# Altium schematic sheet PWM.SchDoc: Inverter
size A3; ApprovedBy: Yves Chevallier; CheckedBy: Yves Chevallier; Author: Yves Chevallier; CompanyName: EPFL; DrawnBy: Yves Chevallier; Engineer: Yves Chevallier; Organization: EPFL; Address1: EPFL; Address2: CH1015 Lausanne; Address3: +41(0)21 693 36 98; Address4: +41(0)21 693 26 00; DocumentNumber: ABC.00.0000.000.0; Revision: v1.0; SheetNumber: 0; SheetTotal: 0; DrawnByDate: 2000-01-01; ExecutionWarrantDate: 2000-01-01; ExecutionWarrant: Yves Chevallier; Context: Confidential; PageSetup: Record=PageOptions|CenterHorizontal=True|CenterVertical=False|PrintScale=0.97|XCorrection=1.00|YCorrection=1.00|PrintKind=0|BorderSize=5000000|LeftOffset=0|BottomOffset=0|Orientation=2|PaperLength=1000|PaperWidth=1000|Scale=100|PaperSource=262|PrintQuality=600|MediaType=1|DitherType=10|PaperKind=A4|PrintScaleMode=1; EngineerDate: 2000-01-01; CheckedByDate: 2000-01-01; ProjectName: PRJ
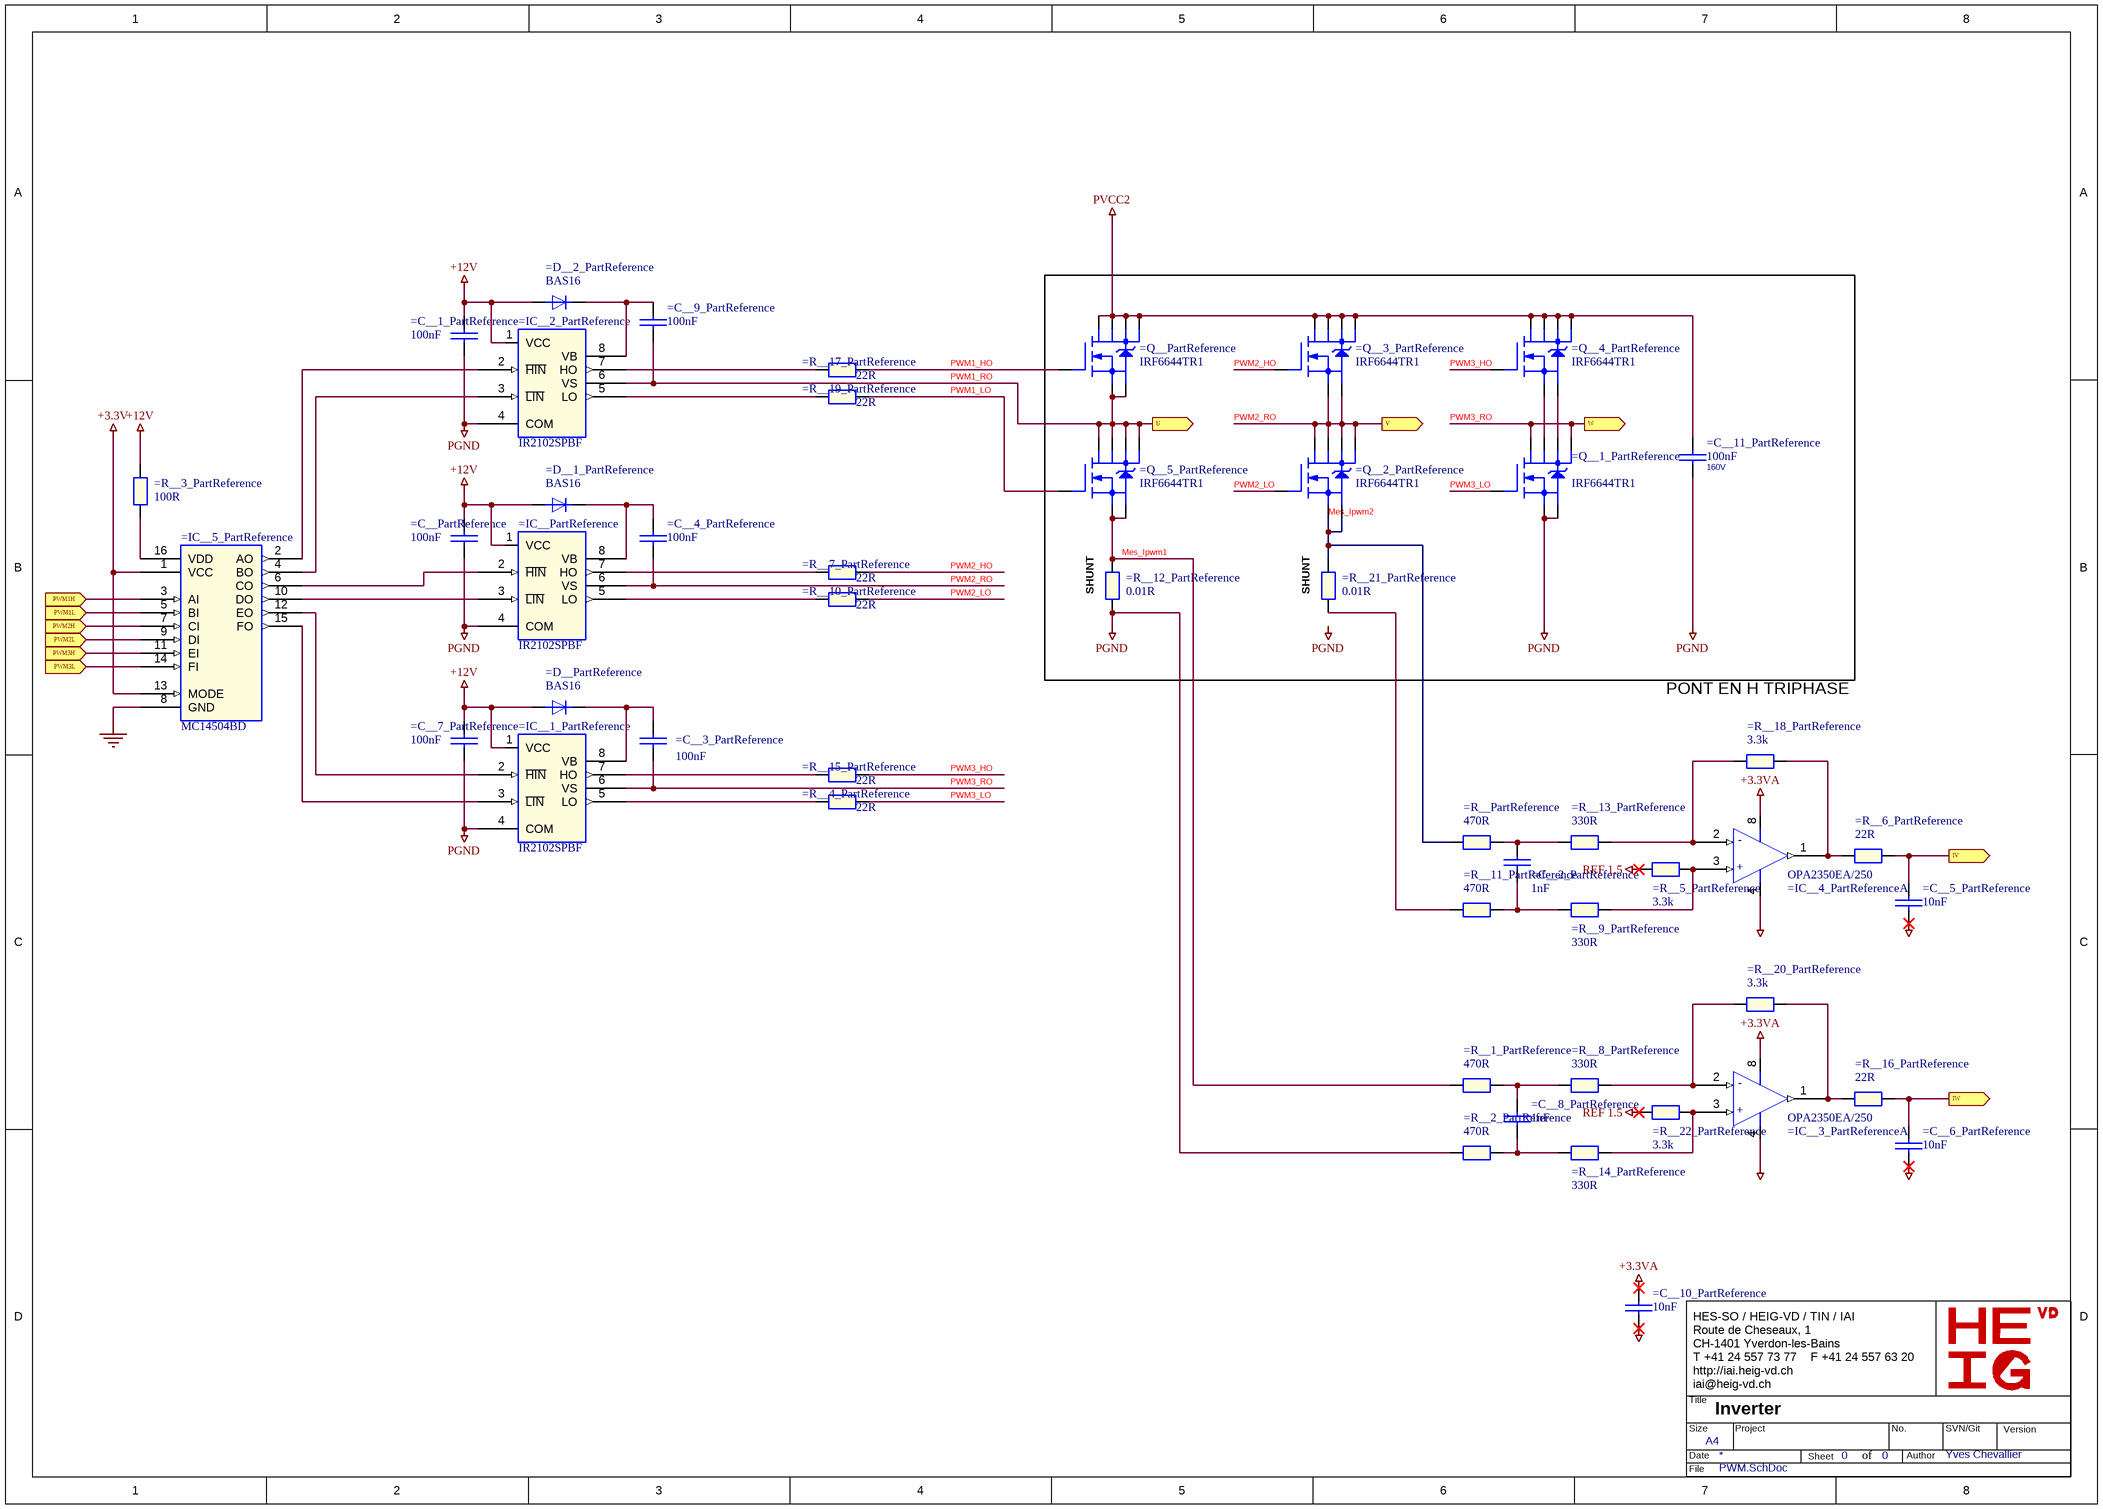
[diagram p0: PWM.SchDoc]

## Parts
=C__1_PartReference  100nF  [SM/C_0805]
=C__2_PartReference  1nF  [SM/C_0805]
=C__3_PartReference  100nF  [SM/C_0805]
=C__4_PartReference  100nF  [SM/C_0805]
=C__5_PartReference  10nF  [SM/C_0805]
=C__6_PartReference  10nF  [SM/C_0805]
=C__7_PartReference  100nF  [SM/C_0805]
=C__8_PartReference  1nF  [SM/C_0805]
=C__9_PartReference  100nF  [SM/C_0805]
=C__10_PartReference  10nF  [SM/C_0805]
=C__11_PartReference  100nF  VOLTAGE: 160V  [SM/C_0805]
=C__PartReference  100nF  [SM/C_0805]
=D__1_PartReference  BAS16  [HEIG/SM/SOT23]
=D__2_PartReference  BAS16  [HEIG/SM/SOT23]
=D__PartReference  BAS16  [HEIG/SM/SOT23]
=IC__1_PartReference  IR2102SPBF  [SOG.050/8/WG.244/L.200]
=IC__2_PartReference  IR2102SPBF  [SOG.050/8/WG.244/L.200]
=IC__3_PartReference  OPA2350EA/250  [HEIG/SM/MSOP8]  (part A of 2)
=IC__4_PartReference  OPA2350EA/250  [HEIG/SM/MSOP8]  (part A of 2)
=IC__5_PartReference  MC14504BD  [SOG.050/16/WG.244/L.400]
=IC__PartReference  IR2102SPBF  [SOG.050/8/WG.244/L.200]
=Q__1_PartReference  IRF6644TR1  [HEIG/DIRECTFET/MN]
=Q__2_PartReference  IRF6644TR1  [HEIG/DIRECTFET/MN]
=Q__3_PartReference  IRF6644TR1  [HEIG/DIRECTFET/MN]
=Q__4_PartReference  IRF6644TR1  [HEIG/DIRECTFET/MN]
=Q__5_PartReference  IRF6644TR1  [HEIG/DIRECTFET/MN]
=Q__PartReference  IRF6644TR1  [HEIG/DIRECTFET/MN]
=R__1_PartReference  470R  [R400]
=R__2_PartReference  470R  [R400]
=R__3_PartReference  100R  [R400]
=R__4_PartReference  22R  [R400]
=R__5_PartReference  3.3k  [R400]
=R__6_PartReference  22R  [R400]
=R__7_PartReference  22R  [R400]
=R__8_PartReference  330R  [R400]
=R__9_PartReference  330R  [R400]
=R__10_PartReference  22R  [R400]
=R__11_PartReference  470R  [R400]
=R__12_PartReference  0.01R  [R400]
=R__13_PartReference  330R  [R400]
=R__14_PartReference  330R  [R400]
=R__15_PartReference  22R  [R400]
=R__16_PartReference  22R  [R400]
=R__17_PartReference  22R  [R400]
=R__18_PartReference  3.3k  [R400]
=R__19_PartReference  22R  [R400]
=R__20_PartReference  3.3k  [R400]
=R__21_PartReference  0.01R  [R400]
=R__22_PartReference  3.3k  [R400]
=R__PartReference  470R  [R400]

## Ports
IV (out), IW (out), PWM1H (in), PWM1L (in), PWM2H (in), PWM2L (in), PWM3H (in), PWM3L (in), U (out), V (out), W (out)

## Nets
+3.3V: =IC__5_PartReference.1(VCC) =IC__5_PartReference.13(MODE)
+3.3VA: =C__10_PartReference.1 =IC__3_PartReference.8(+VCC) =IC__4_PartReference.8(+VCC)
+12V: =C__1_PartReference.1 =C__7_PartReference.1 =C__PartReference.1 =D__1_PartReference.1(a) =D__2_PartReference.1(a) =D__PartReference.1(a) =IC__1_PartReference.1(VCC) =IC__2_PartReference.1(VCC) =IC__PartReference.1(VCC) =R__3_PartReference.2
AGND: =C__5_PartReference.2 =C__6_PartReference.2 =C__10_PartReference.2 =IC__3_PartReference.4(-VCC) =IC__4_PartReference.4(-VCC)
GND: =IC__5_PartReference.8(GND)
PGND: =C__1_PartReference.2 =C__7_PartReference.2 =C__11_PartReference.2 =C__PartReference.2 =IC__1_PartReference.4(COM) =IC__2_PartReference.4(COM) =IC__PartReference.4(COM) =Q__1_PartReference.S1(S) =Q__1_PartReference.S2(S) =R__2_PartReference.1 =R__12_PartReference.2
PVCC2: =C__11_PartReference.1 =Q__3_PartReference.D1(D) =Q__3_PartReference.D2(D) =Q__3_PartReference.D3(D) =Q__3_PartReference.D4(D) =Q__4_PartReference.D1(D) =Q__4_PartReference.D2(D) =Q__4_PartReference.D3(D) =Q__4_PartReference.D4(D) =Q__PartReference.D1(D) =Q__PartReference.D2(D) =Q__PartReference.D3(D) =Q__PartReference.D4(D)
REF 1.5: =R__5_PartReference.1 =R__22_PartReference.1
IV: =C__5_PartReference.1 =R__6_PartReference.2 ; port IV
IW: =C__6_PartReference.1 =R__16_PartReference.2 ; port IW
Mes_Ipwm1: =Q__5_PartReference.S1(S) =Q__5_PartReference.S2(S) =R__1_PartReference.1 =R__12_PartReference.1
Mes_Ipwm2: =Q__2_PartReference.S1(S) =Q__2_PartReference.S2(S) =R__21_PartReference.1 =R__PartReference.1
PWM1_HO: =Q__PartReference.G =R__17_PartReference.2
PWM1_LO: =Q__5_PartReference.G =R__19_PartReference.2
PWM1_RO: =C__9_PartReference.2 =IC__2_PartReference.6(VS) =Q__5_PartReference.D1(D) =Q__5_PartReference.D2(D) =Q__5_PartReference.D3(D) =Q__5_PartReference.D4(D) =Q__PartReference.S1(S) =Q__PartReference.S2(S) ; port U
PWM1H: =IC__5_PartReference.3(AI) ; port PWM1H
PWM1L: =IC__5_PartReference.5(BI) ; port PWM1L
PWM2_HO: =Q__3_PartReference.G =R__7_PartReference.2
PWM2_LO: =Q__2_PartReference.G =R__10_PartReference.2
PWM2_RO: =C__4_PartReference.2 =IC__PartReference.6(VS) =Q__2_PartReference.D1(D) =Q__2_PartReference.D2(D) =Q__2_PartReference.D3(D) =Q__2_PartReference.D4(D) =Q__3_PartReference.S1(S) =Q__3_PartReference.S2(S) ; port V
PWM2H: =IC__5_PartReference.7(CI) ; port PWM2H
PWM2L: =IC__5_PartReference.9(DI) ; port PWM2L
PWM3_HO: =Q__4_PartReference.G =R__15_PartReference.2
PWM3_LO: =Q__1_PartReference.G =R__4_PartReference.2
PWM3_RO: =C__3_PartReference.2 =IC__1_PartReference.6(VS) =Q__1_PartReference.D3(D) =Q__1_PartReference.D4(D) ; port W
PWM3H: =IC__5_PartReference.11(EI) ; port PWM3H
PWM3L: =IC__5_PartReference.14(FI) ; port PWM3L
Net=C__2_PartReference_1: =C__2_PartReference.1 =R__13_PartReference.1 =R__PartReference.2
Net=C__2_PartReference_2: =C__2_PartReference.2 =R__9_PartReference.1 =R__11_PartReference.2
Net=C__3_PartReference_1: =C__3_PartReference.1 =D__PartReference.3(k) =IC__1_PartReference.8(VB)
Net=C__4_PartReference_1: =C__4_PartReference.1 =D__1_PartReference.3(k) =IC__PartReference.8(VB)
Net=C__8_PartReference_1: =C__8_PartReference.1 =R__1_PartReference.2 =R__8_PartReference.1
Net=C__8_PartReference_2: =C__8_PartReference.2 =R__2_PartReference.2 =R__14_PartReference.1
Net=C__9_PartReference_1: =C__9_PartReference.1 =D__2_PartReference.3(k) =IC__2_PartReference.8(VB)
Net=IC__1_PartReference_2: =IC__1_PartReference.2(~{HIN}) =IC__5_PartReference.12(EO)
Net=IC__1_PartReference_3: =IC__1_PartReference.3(~{LIN}) =IC__5_PartReference.15(FO)
Net=IC__1_PartReference_5: =IC__1_PartReference.5(LO) =R__4_PartReference.1
Net=IC__1_PartReference_7: =IC__1_PartReference.7(HO) =R__15_PartReference.1
Net=IC__2_PartReference_2: =IC__2_PartReference.2(~{HIN}) =IC__5_PartReference.2(AO)
Net=IC__2_PartReference_3: =IC__2_PartReference.3(~{LIN}) =IC__5_PartReference.4(BO)
Net=IC__2_PartReference_5: =IC__2_PartReference.5(LO) =R__19_PartReference.1
Net=IC__2_PartReference_7: =IC__2_PartReference.7(HO) =R__17_PartReference.1
Net=IC__3_PartReference_1: =IC__3_PartReference.1(OUT) =R__16_PartReference.1 =R__20_PartReference.2
Net=IC__3_PartReference_2: =IC__3_PartReference.2(-IN) =R__8_PartReference.2 =R__20_PartReference.1
Net=IC__3_PartReference_3: =IC__3_PartReference.3(+IN) =R__14_PartReference.2 =R__22_PartReference.2
Net=IC__4_PartReference_1: =IC__4_PartReference.1(OUT) =R__6_PartReference.1 =R__18_PartReference.2
Net=IC__4_PartReference_2: =IC__4_PartReference.2(-IN) =R__13_PartReference.2 =R__18_PartReference.1
Net=IC__4_PartReference_3: =IC__4_PartReference.3(+IN) =R__5_PartReference.2 =R__9_PartReference.2
Net=IC__5_PartReference_6: =IC__5_PartReference.6(CO) =IC__PartReference.2(~{HIN})
Net=IC__5_PartReference_10: =IC__5_PartReference.10(DO) =IC__PartReference.3(~{LIN})
Net=IC__5_PartReference_16: =IC__5_PartReference.16(VDD) =R__3_PartReference.1
Net=IC__PartReference_5: =IC__PartReference.5(LO) =R__10_PartReference.1
Net=IC__PartReference_7: =IC__PartReference.7(HO) =R__7_PartReference.1
Net=Q__1_PartReference_D1: =Q__1_PartReference.D1(D) =Q__4_PartReference.S1(S)
Net=Q__1_PartReference_D2: =Q__1_PartReference.D2(D) =Q__4_PartReference.S2(S)
Net=R__11_PartReference_1: =R__11_PartReference.1 =R__21_PartReference.2

## Notes on the sheet
- (near =R__12_PartReference) SHUNT
- (near =R__21_PartReference) SHUNT
- PONT EN H TRIPHASE
- Labels drawn without touching a wire or pin: PGND
- HES-SO / HEIG-VD / TIN / IAI
  Route de Cheseaux, 1
  CH-1401 Yverdon-les-Bains
  T +41 24 557 73 77    F +41 24 557 63 20
  http://iai.heig-vd.ch
  iai@heig-vd.ch
- Title
- Size
- Date
- A4
- Project
- Sheet
- of
- No.
- Author
- SVN/Git
- Version
- File
- (in symbol OPA2340_2, part A) -; +

## Library data of the parts
=C__1_PartReference =C__7_PartReference =C__PartReference = C_Dup1: Tolérance: 10%; Prix: 0.154; Ref. Fabricant: 2238 910 15649; Fabricant: PHYCOMP; Quantité min: 10; PCB Footprint: HEIG/SM/C_0805; Ref. Distributeur: 644249; Distributeur: Farnell
=C__2_PartReference =C__8_PartReference = C_Dup1: Tolérance: 5%; Ref. Fabricant: GRM1885C1H102JA01DMURATA; Prix: 0.153; Fabricant: MURATA; Quantité min: 10; PCB Footprint: HEIG/SM/C_0603; Distributeur: Farnell; Ref. Distributeur: 8819920
=C__3_PartReference =C__4_PartReference = C_Dup1: Tolérance: 10%; Prix: 0.7; Ref. Fabricant: 08051C104KAZ2A; Fabricant: AVX; Quantité min: 5; PCB Footprint: HEIG/SM/C_0805; Ref. Distributeur: 1301805; Distributeur: Farnell
=C__5_PartReference =C__6_PartReference =C__10_PartReference = C_Dup1: Ref. Fabricant: GRM188R71H103KA01D; Prix: 0.071; Fabricant: MURATA; Quantité min: 10; PCB Footprint: HEIG/SM/C_0603; Ref. Distributeur: 8819980; Distributeur: Farnell
=C__9_PartReference = C_Dup1: Tolérance: 10%; Quantité min: 5; Fabricant: AVX; Ref. Fabricant: 08051C104KAZ2A; Prix: 0.7; PCB Footprint: HEIG/SM/C_0805; Distributeur: Farnell; Ref. Distributeur: 1301805
=C__11_PartReference = C_Dup1: PCB Footprint: MKP1837-410; Prix: 2.10; Ref. Fabricant: MKP1837-410-161-G; Fabricant: VISHAY ROEDERSTEIN; Quantité min: 5; Distributeur: Farnell; Ref. Distributeur: 1166887
=D__1_PartReference = D_2: Quantité min: 10; Fabricant: NXP; Prix: 0.196; Voltage: 85V; PCB Footprint: HEIG/SM/SOT23; Ref. Distributeur: 1081180; Ref. Fabricant: BAS16; Distributeur: Farnell
=D__2_PartReference = D_4: Quantité min: 10; Fabricant: NXP; Prix: 0.196; Voltage: 85V; Ref. Distributeur: 1081180; Ref. Fabricant: BAS16; Distributeur: Farnell; PCB Footprint: HEIG/SM/SOT23
=D__PartReference = D_3: Voltage: 85V; Prix: 0.196; Fabricant: NXP; Quantité min: 10; PCB Footprint: HEIG/SM/SOT23; Distributeur: Farnell; Ref. Fabricant: BAS16; Ref. Distributeur: 1081180
=IC__1_PartReference =IC__2_PartReference = IR2102/SO_0: Quantité min: 1; Fabricant: INTERNATIONAL RECTIFIER; Prix: 8.10; PCB Footprint: SOG.050/8/WG.244/L.200; Ref. Distributeur: 9101829; Ref. Fabricant: IR2102SPBF; Distributeur: Farnell
=IC__3_PartReference =IC__4_PartReference = OPA2340_2: Prix: 7.20; Fabricant: TEXAS INSTRUMENTS; Quantité min: 1; PCB Footprint: HEIG/SM/MSOP8; Ref. Distributeur: 1097493; Ref. Fabricant: OPA2350EA/250; Distributeur: Farnell
=IC__5_PartReference = CD4504BMS_1: Ref. Fabricant: MC14504BDG; Prix: 2.60; FPLIST: SOG.050/16/WG.420/L.425; Fabricant: ON SEMICONDUCTOR; Quantité min: 1; Distributeur: Farnell; Ref. Distributeur: 9665218; PCB Footprint: SOG.050/16/WG.244/L.400
=IC__PartReference = IR2102/SO_0_Dup1: Prix: 8.10; Fabricant: INTERNATIONAL RECTIFIER; Quantité min: 1; Distributeur: Farnell; Ref. Fabricant: IR2102SPBF; Ref. Distributeur: 9101829; PCB Footprint: SOG.050/8/WG.244/L.200
=Q__1_PartReference = IRF3710S/SM_0: Prix: 8.75; Fabricant: INTERNATIONAL RECTIFIER; Quantité min: 1; Ref. Distributeur: 1078423; Ref. Fabricant: IRF6644TR1; Distributeur: Farnell; PCB Footprint: HEIG/DIRECTFET/MN
=Q__2_PartReference =Q__3_PartReference =Q__4_PartReference =Q__5_PartReference =Q__PartReference = IRF3710S/SM_0: Quantité min: 1; Prix: 8.75; Fabricant: INTERNATIONAL RECTIFIER; Ref. Distributeur: 1078423; Ref. Fabricant: IRF6644TR1; Distributeur: Farnell; PCB Footprint: HEIG/DIRECTFET/MN
=R__1_PartReference =R__2_PartReference =R__11_PartReference =R__PartReference = R_Dup1: Tolérance: 5%; PCB Footprint: HEIG/SM/R_0603; Prix: 0.064; Ref. Fabricant: MC 0.063W 0603 5% 470R; Fabricant: MULTICOMP; Quantité min: 50; Distributeur: Farnell; Ref. Distributeur: 9332146
=R__3_PartReference = R_Dup1: PCB Footprint: SM/R_0805; Ref. Fabricant: MC 0.1W 0805 5% 100R; Prix: 0.064; Fabricant: MULTICOMP; Quantité min: 50; Tolérance: 5%; Distributeur: Farnell; Ref. Distributeur: 9333703
=R__4_PartReference =R__7_PartReference =R__10_PartReference =R__15_PartReference =R__17_PartReference =R__19_PartReference = R_Dup1: Tolérance: 5%; PCB Footprint: SM/R_0805; Prix: 0.064; Ref. Fabricant: MC 0.1W 0805 5% 22R; Fabricant: MULTICOMP; Quantité min: 50; Distributeur: Farnell; Ref. Distributeur: 9334122
=R__5_PartReference =R__20_PartReference =R__22_PartReference = R_Dup1: Quantité min: 50; Fabricant: MULTICOMP; Ref. Fabricant: MC 0.063W 0603 5% 12K; Prix: 0.064; Tolérance: 5%; PCB Footprint: HEIG/SM/R_0603; Ref. Distributeur: 9331760; Distributeur: Farnell
=R__6_PartReference =R__16_PartReference = R_Dup1: PCB Footprint: HEIG/SM/R_0603; Prix: 0.064; Ref. Fabricant: MC 0.063W 0603 5% 22R; Fabricant: MULTICOMP; Quantité min: 50; Ref. Distributeur: 9331891; Distributeur: Farnell
=R__8_PartReference =R__9_PartReference =R__14_PartReference = R_Dup1: Tolérance: 5%; PCB Footprint: HEIG/SM/R_0603; Prix: 0.064; Ref. Fabricant: MC 0.063W 0603 5% 330R; Quantité min: 50; Fabricant: MULTICOMP; Distributeur: Farnell; Ref. Distributeur: 9332014
=R__12_PartReference =R__21_PartReference = R_Dup1: Tolérance: 1%; Voltage: 200V; PCB Footprint: SM/R_2010; Prix: 3.40; Ref. Fabricant: LRF2010-R01FW; Fabricant: WELMYN; Quantité min: 5; Ref. Distributeur: 1100044; Distributeur: Farnell
=R__13_PartReference = R_Dup1: Tolérance: 5%; PCB Footprint: HEIG/SM/R_0603; Prix: 0.064; Ref. Fabricant: MC 0.063W 0603 5% 330R; Fabricant: MULTICOMP; Quantité min: 50; Distributeur: Farnell; Ref. Distributeur: 9332014
=R__18_PartReference = R_Dup1: Tolérance: 5%; Prix: 0.064; Ref. Fabricant: MC 0.063W 0603 5% 12K; Fabricant: MULTICOMP; Quantité min: 50; PCB Footprint: HEIG/SM/R_0603; Distributeur: Farnell; Ref. Distributeur: 9331760